# Altium schematic sheet FOC_ESC.SchDoc
size 431 x 279 mm; SheetNumber: 1; SheetTotal: 1
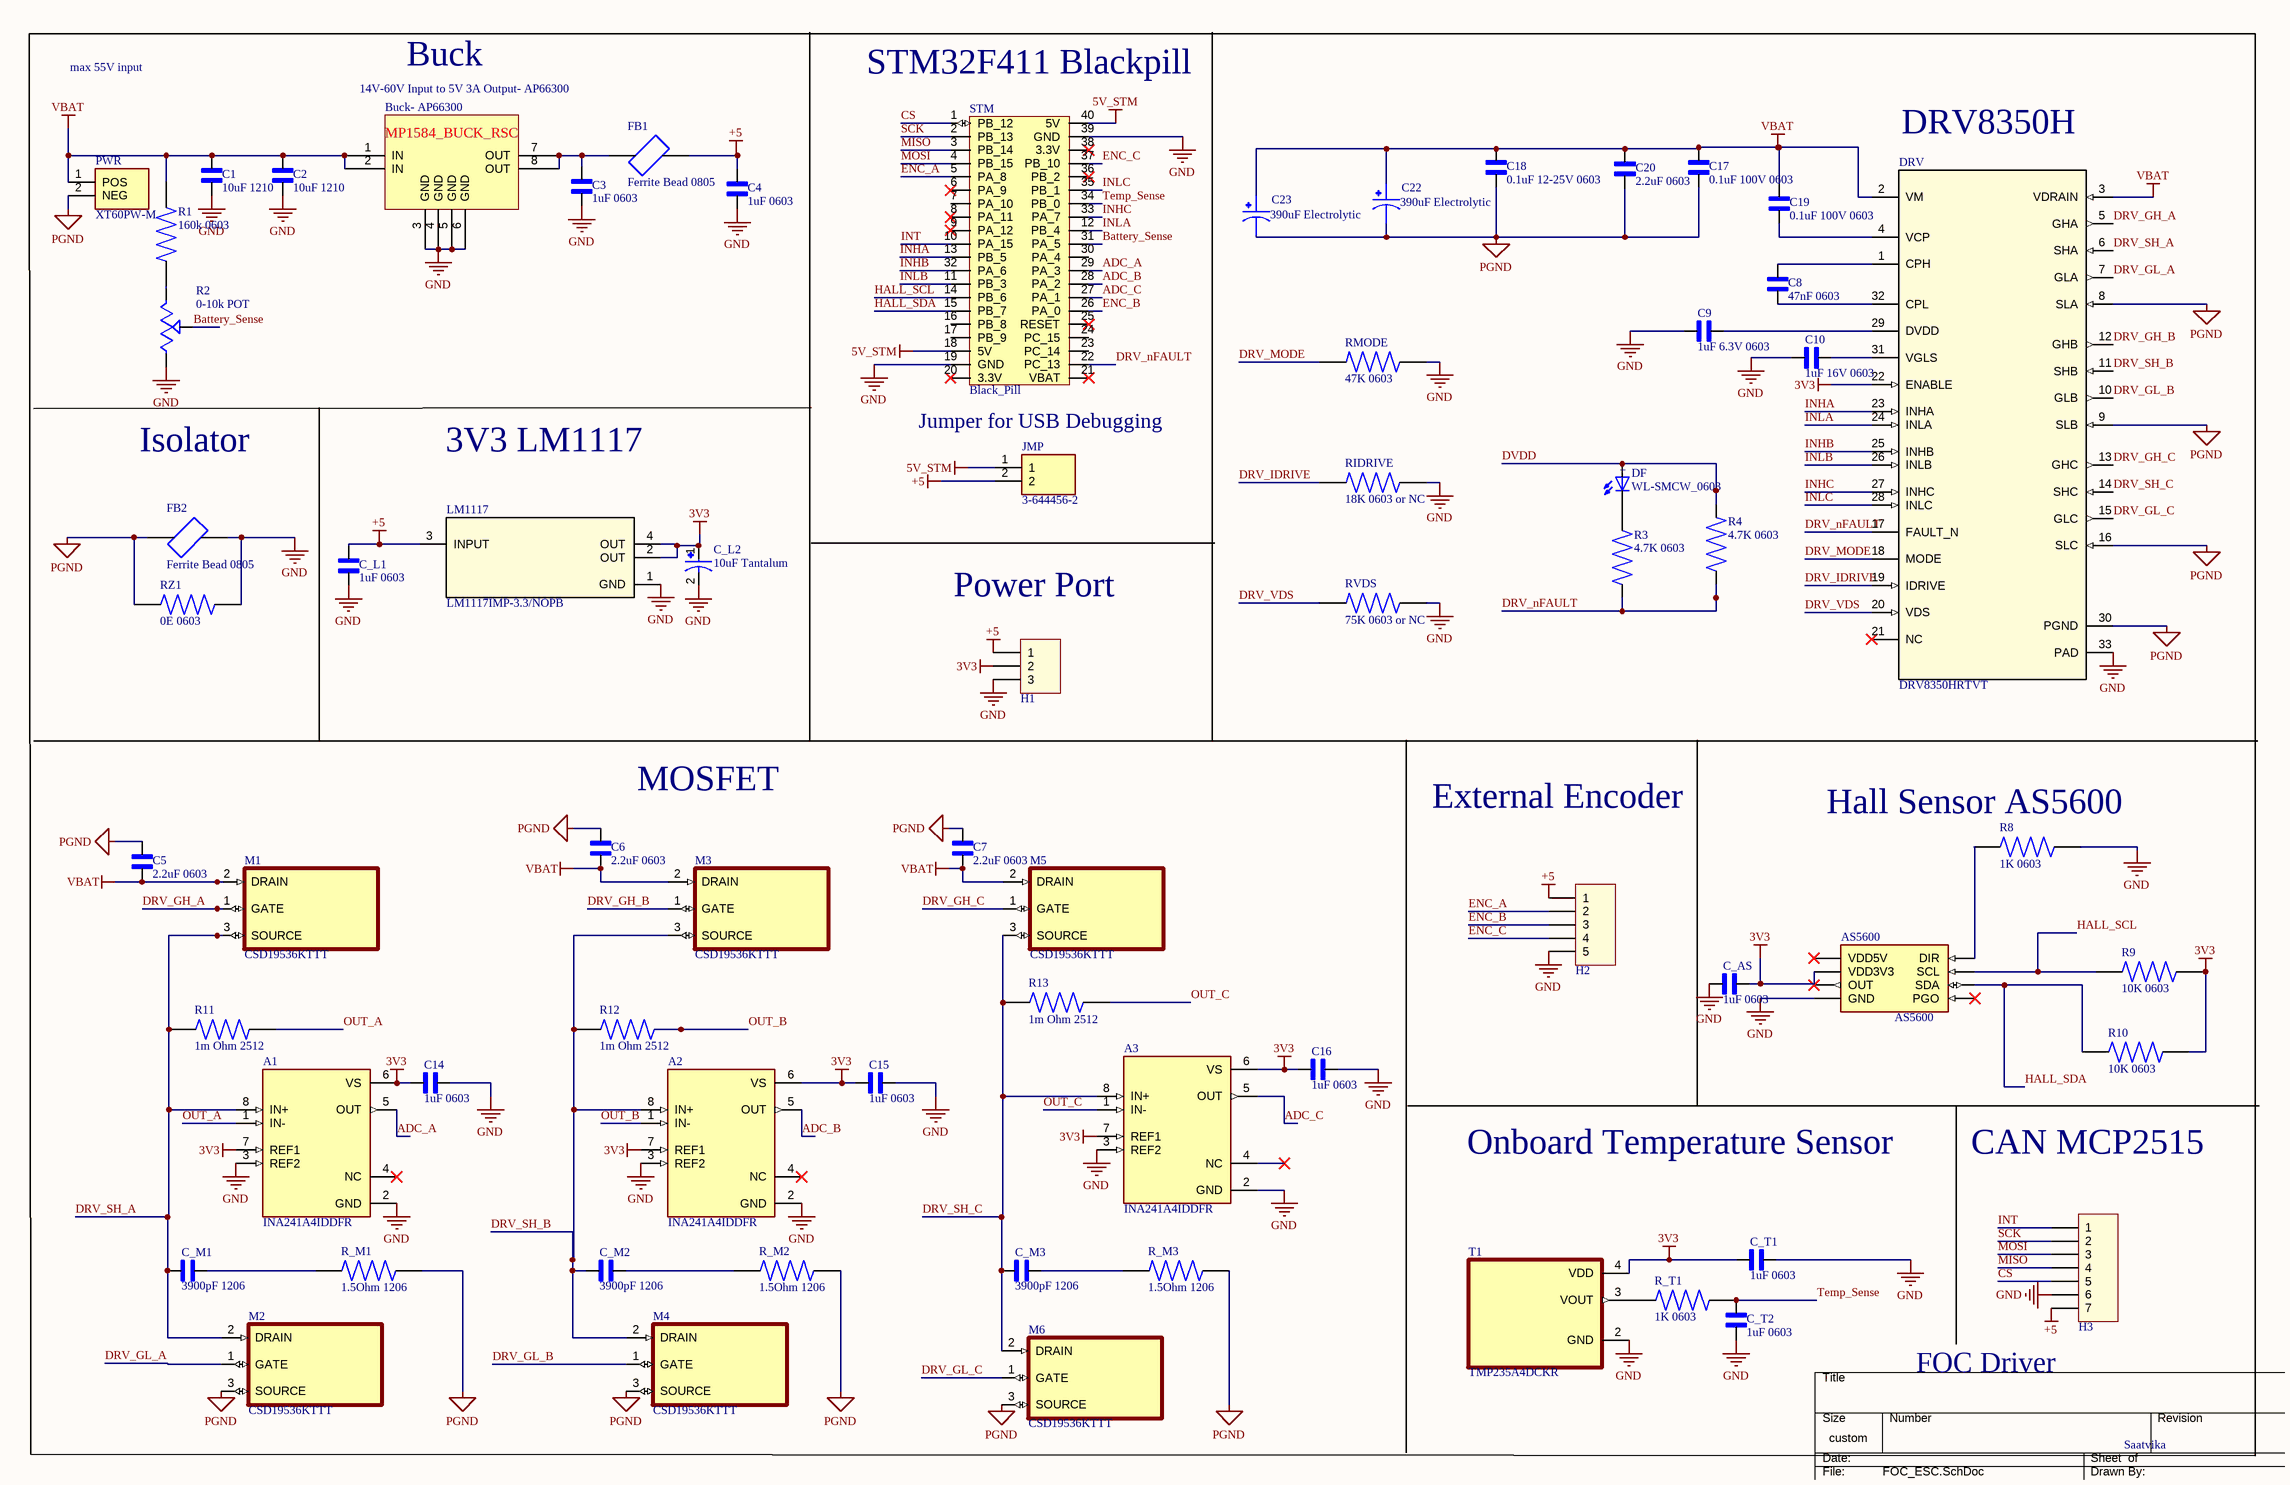
[diagram p0: FOC_ESC.SchDoc]

## Parts
A1  INA241A4IDDFR  [SOT65P280X110-8N]
A2  INA241A4IDDFR  [SOT65P280X110-8N]
A3  INA241A4IDDFR  [SOT65P280X110-8N]
AS5600  AS5600  [SOIC8]  (value not drawn)
Buck-_AP66300  (no value)  [MP1584]
C1  10uF 1210  [CAPC3225X280N]
C2  10uF 1210  [CAPC3225X280N]
C3  1uF 0603  [CAPC1608X90]
C4  1uF 0603  [CAPC1608X90]
C5  2.2uF 0603  [CAPC1608X90]
C6  2.2uF 0603  [CAPC1608X90]
C7  2.2uF 0603  [CAPC1608X90]
C8  47nF 0603  [CAPC1608X90]
C9  1uF 6.3V 0603  [CAPC1608X90]
C10  1uF 16V 0603  [CAPC1608X90]
C14  1uF 0603  [CAPC1608X90]
C15  1uF 0603  [CAPC1608X90]
C16  1uF 0603  [CAPC1608X90]
C17  0.1uF 100V 0603  [CAPC1608X90]
C18  0.1uF 12-25V 0603  [CAPC1608X90]
C19  0.1uF 100V 0603  [CAPC1608X90]
C20  2.2uF 0603  [CAPC1608X90]
C22  390uF Electrolytic  [CAPAE1280X1400N]
C23  390uF Electrolytic  [CAPAE1280X1400N]
C_AS  1uF 0603  [CAPC1608X90]
C_L1  1uF 0603  [CAPC1608X90]
C_L2  10uF Tantalum  [CAPMP3528X210N]
C_M1  3900pF 1206  [CAPC3216X110N]
C_M2  3900pF 1206  [CAPC3216X110N]
C_M3  3900pF 1206  [CAPC3216X110N]
C_T1  1uF 0603  [CAPC1608X90]
C_T2  1uF 0603  [CAPC1608X90]
DF  WL-SMCW_0603  [WL-SMCW_0603]
DRV  DRV8350HRTVT  [RTV0032E]
FB1  Ferrite Bead 0805  [FB_MI0805K400R-10]
FB2  Ferrite Bead 0805  [FB_MI0805K400R-10]
H1  61300311021  [61300311021]  (value not drawn)
H2  61300511021  [61300511021]  (value not drawn)
H3  61300711121  [61300711121]  (value not drawn)
JMP  3-644456-2  [TE_3-644456-2]
LM1117  LM1117IMP-3.3/NOPB  [DCY0004A_N]
M1  CSD19536KTTT  [TO254P1524X483-4N]
M2  CSD19536KTTT  [TO254P1524X483-4N]
M3  CSD19536KTTT  [TO254P1524X483-4N]
M4  CSD19536KTTT  [TO254P1524X483-4N]
M5  CSD19536KTTT  [TO254P1524X483-4N]
M6  CSD19536KTTT  [TO254P1524X483-4N]
PWR  XT60PW-M  [AMASS_XT60PW-M]
R1  160k 0603  [RESC1607X60N]
R2  0-10k POT  [TRIM_3313J-2-104E]
R3  4.7K 0603  [RESC1607X60N]
R4  4.7K 0603  [RESC1607X60N]
R8  1K 0603  [RESC1607X60N]
R9  10K 0603  [RESC1607X60N]
R10  10K 0603  [RESC1607X60N]
R11  1m Ohm 2512  [RESC6432X90N]
R12  1m Ohm 2512  [RESC6432X90N]
R13  1m Ohm 2512  [RESC6432X90N]
R_M1  1.5Ohm 1206  [RESC3116X65N]
R_M2  1.5Ohm 1206  [RESC3116X65N]
R_M3  1.5Ohm 1206  [RESC3116X65N]
R_T1  1K 0603  [RESC1607X60N]
RIDRIVE  18K 0603 or NC  [RESC1607X60N]
RMODE  47K 0603  [RESC1607X60N]
RVDS  75K 0603 or NC  [RESC1607X60N]
RZ1  0E 0603  [RESC1607X60N]
STM  Black_Pill  [Black_Pill_STM32F401CCU6]
T1  TMP235A4DCKR  [SOT65P210X110-5N]

## Nets
3V3: A1.6(VS) A1.7(REF1) A2.6(VS) A2.7(REF1) A3.6(VS) A3.7(REF1) AS5600.2(VDD3V3) C14.2 C15.2 C16.2 C_AS.1 C_L2.1 C_T1.1 DRV.22(ENABLE) H1.2 LM1117.2(OUT) LM1117.4(OUT) R9.2 R10.2 T1.4(VDD)
5V_STM: JMP.1 STM.18(5V) STM.40(5V)
+5: C4.2 C_L1.2 FB1.2 H1.1 H2.1 H3.7 JMP.2 LM1117.3(INPUT)
GND: A1.2(GND) A1.3(REF2) A2.2(GND) A2.3(REF2) A3.2(GND) A3.3(REF2) AS5600.4(GND) Buck-_AP66300.3(GND) Buck-_AP66300.4(GND) Buck-_AP66300.5(GND) Buck-_AP66300.6(GND) C1.1 C2.1 C3.1 C4.1 C9.1 C10.2 C14.1 C15.1 C16.1 C_AS.2 C_L1.1 C_L2.2 C_T1.2 C_T2.1 DRV.33(PAD) FB2.2 H1.3 H2.5 H3.6 LM1117.1(GND) R2.1(CCW) R8.2 RIDRIVE.2 RMODE.2 RVDS.2 RZ1.2 STM.19(GND) STM.39(GND) T1.2(GND)
PGND: C5.2 C6.2 C7.2 C17.1 C18.1 C20.1 C22.2 C23.2 DRV.8(SLA) DRV.9(SLB) DRV.16(SLC) DRV.30(PGND) FB2.1 M2.3(SOURCE) M4.3(SOURCE) M6.3(SOURCE) PWR.2(NEG) R_M1.2 R_M2.2 R_M3.2 RZ1.1
VBAT: Buck-_AP66300.1(IN) Buck-_AP66300.2(IN) C1.2 C2.2 C5.1 C6.1 C7.1 C17.2 C18.2 C19.2 C20.2 C22.1 C23.1 DRV.2(VM) DRV.3(VDRAIN) M1.2(DRAIN) M3.2(DRAIN) M5.2(DRAIN) PWR.1(POS) R1.1
ADC_A: A1.5(OUT) STM.29(PA_3)
ADC_B: A2.5(OUT) STM.28(PA_2)
ADC_C: A3.5(OUT) STM.27(PA_1)
Battery_Sense: R2.2(WIPER) STM.31(PA_5)
CS: H3.5 STM.1(PB_12)
DRV_GH_A: DRV.5(GHA) M1.1(GATE)
DRV_GH_B: DRV.12(GHB) M3.1(GATE)
DRV_GH_C: DRV.13(GHC) M5.1(GATE)
DRV_GL_A: DRV.7(GLA) M2.1(GATE)
DRV_GL_B: DRV.10(GLB) M4.1(GATE)
DRV_GL_C: DRV.15(GLC) M6.1(GATE)
DRV_IDRIVE: DRV.19(IDRIVE) RIDRIVE.1
DRV_MODE: DRV.18(MODE) RMODE.1
DRV_nFAULT: DRV.17(FAULT_N) R3.2 R4.2 STM.22(PC_13)
DRV_SH_A: A1.8(IN+) C_M1.2 DRV.6(SHA) M1.3(SOURCE) M2.2(DRAIN) R11.1
DRV_SH_B: A2.8(IN+) C_M2.2 DRV.11(SHB) M3.3(SOURCE) M4.2(DRAIN) R12.1
DRV_SH_C: A3.8(IN+) C_M3.2 DRV.14(SHC) M5.3(SOURCE) M6.2(DRAIN) R13.1
DRV_VDS: DRV.20(VDS) RVDS.1
DVDD: DF.2(POS) R4.1
ENC_A: H2.2 STM.5(PA_8)
ENC_B: H2.3 STM.26(PA_0)
ENC_C: H2.4 STM.37(PB_10)
HALL_SCL: AS5600.7(SCL) R9.1 STM.14(PB_6)
HALL_SDA: AS5600.6(SDA) R10.1 STM.15(PB_7)
INHA: DRV.23(INHA) STM.13(PB_5)
INHB: DRV.25(INHB) STM.32(PA_6)
INHC: DRV.27(INHC) STM.33(PA_7)
INLA: DRV.24(INLA) STM.12(PB_4)
INLB: DRV.26(INLB) STM.11(PB_3)
INLC: DRV.28(INLC) STM.35(PB_1)
INT: H3.1 STM.10(PA_15)
MISO: H3.4 STM.3(PB_14)
MOSI: H3.3 STM.4(PB_15)
OUT_A: A1.1(IN-) R11.2
OUT_B: A2.1(IN-) R12.2
OUT_C: A3.1(IN-) R13.2
SCK: H3.2 STM.2(PB_13)
Temp_Sense: C_T2.2 R_T1.2 STM.34(PB_0)
NetAS5600_8: AS5600.8(DIR) R8.1
NetBuck-_AP66300_7: Buck-_AP66300.7(OUT) Buck-_AP66300.8(OUT) C3.2 FB1.1
NetC8_1: C8.1 DRV.32(CPL)
NetC8_2: C8.2 DRV.1(CPH)
NetC9_2: C9.2 DRV.29(DVDD)
NetC10_1: C10.1 DRV.31(VGLS)
NetC19_1: C19.1 DRV.4(VCP)
NetC_M1_1: C_M1.1 R_M1.1
NetC_M2_1: C_M2.1 R_M2.1
NetC_M3_1: C_M3.1 R_M3.1
NetDF_1: DF.1(NEG) R3.1
NetR1_2: R1.2 R2.3(CW)
NetR_T1_1: R_T1.1 T1.3(VOUT)

Not connected (* = marked no-connect by the designer): A1 4(NC)*; A2 4(NC)*; A3 4(NC)*; AS5600 1(VDD5V)* 3(OUT)* 5(PGO)*; DRV 21(NC)*; STM 6(PA_9)* 7(PA_10) 8(PA_11)* 9(PA_12)* 16(PB_8) 17(PB_9) 20(3.3V)* 21(VBAT)* 23(PC_14) 24(PC_15) 25(RESET)* 30(PA_4) 36(PB_2)* 38(3.3V)*

## Notes on the sheet
- max 55V input
- 14V-60V Input to 5V 3A Output- AP66300
- Buck
- (near STM) STM32F411 Blackpill
- DRV8350H
- Jumper for USB Debugging
- Isolator
- 3V3 LM1117
- (near H1) Power Port
- MOSFET
- External Encoder
- (near R8) Hall Sensor AS5600
- Onboard Temperature Sensor
- CAN MCP2515
- (near H3) FOC Driver
- Saatvika
- DWG. NO.
- REV.
- SHT.
- THIS DOCUMENT AND THE DATA DISCLOSED HEREIN OR HEREWITH IS THE PROPERTY OF ALTIUM LIMITED AND MAY BE FREELY DISTRIBUTED IN WHOLE. NO RIGHTS ARE RESERVED OR EXPRESS OR IMPLIED WARANTEE GIVEN.
- REVISION
- DESCRIPTION
- DATE
- APPROVED
- ENG:
- APPROVALS
- PROJECT
- DSN:
- CHK:
- REFERENCE DOCUMENTS
- PROJECT REVISION:
- TITLE
- DOCUMENT REVISION:
- DESIGN ITEM:
- BOM:
- FAB DWG:
- PCB DWG:
- ASSY DWG:
- SCALE:
- SIZE
- B
- CAGE CODE
- FILE NAME
- DWG NO.
- SHEET
- OF
- REV
- (in symbol MP1584 Buck Convertor) MP1584_BUCK_RSC
- (in symbol WL-SMCW_0603) +

## Library data of the parts
A1-A3 = INA241A3IDDFR: -5-V to 110-V bidirectional ultraprecise current sense amplifier with enhanced PWM rejection; MF: Texas Instruments; Package: None; Price: None; Check_prices: https://www.snapeda.com/parts/INA241A3IDDFR/Texas+Instruments/view-part/?ref=eda; Value: *; SnapEDA_Link: https://www.snapeda.com/parts/INA241A3IDDFR/Texas+Instruments/view-part/?ref=snap; MP: INA241A3IDDFR; Availability: In Stock; Purchase-URL: https://pricing.snapeda.com/search?q=INA241A3IDDFR&ref=eda
AS5600 = AS5600: Hall Effect Sensor Rotary Position External Magnet, Not Included Gull Wing; MF: Ams AG; SnapEDA_Link: https://www.snapeda.com/parts/AS5600/ams/view-part/?ref=snap; Package: None; Value: *; MP: AS5600; Check_prices: https://www.snapeda.com/parts/AS5600/ams/view-part/?ref=eda
Buck-_AP66300 = MP1584 Buck Convertor
C1 C2 = C1210C106K5RACTU: 10 ÂµF Â±10% 50V Ceramic Capacitor X7R 1210 (3225 Metric); MF: KEMET; SnapEDA_Link: https://www.snapeda.com/parts/C1210C106K5RACTU/KEMET/view-part/?ref=snap; Package: 1210-2 KEMET; Value: *; MP: C1210C106K5RACTU; Check_prices: https://www.snapeda.com/parts/C1210C106K5RACTU/KEMET/view-part/?ref=eda
C3-C10 C14-C20 C_AS C_L1 C_T1 C_T2 = CC0603KRX7R9BB104: 0.1 ÂµF Â±10% 50V Ceramic Capacitor X7R 0603 (1608 Metric); MF: Yageo; SnapEDA_Link: https://www.snapeda.com/parts/CC0603KRX7R9BB104/Yageo/view-part/?ref=snap; Package: 0603 Yageo; Value: *; MP: CC0603KRX7R9BB104; Check_prices: https://www.snapeda.com/parts/CC0603KRX7R9BB104/Yageo/view-part/?ref=eda
C22 C23 = EDH475M450A9RAA: ALU Electrolytic, SMD, EDH, +85Â°C, 450VDC, 12.5ÂµF, 12.5 x 13.5 ¦ KEMET EDH475M450A9RAA; SnapEDA_Link: https://www.snapeda.com/parts/EDH475M450A9RAA/KEMET/view-part/?ref=snap; Package: Radial KEMET; Value: *; MF: KEMET; MP: EDH475M450A9RAA; Check_prices: https://www.snapeda.com/parts/EDH475M450A9RAA/KEMET/view-part/?ref=eda
C_L2 = T543B337K2R5AHW035: Cap Tant Polymer 330uF 2.5VDC B CASE 10% (3.5 X 2.8 X 1.9mm) SMD 3528-21 0.035 Ohm 105Â°C T/R; MF: KEMET; Check_prices: https://www.snapeda.com/parts/T543B337K2R5AHW035/KEMET/view-part/1714462/?ref=eda; Availability: In Stock; Value: *; Price: None; Purchase-URL: https://pricing.snapeda.com/search/part/T543B337K2R5AHW035/?ref=eda; MP: T543B337K2R5AHW035; Package: SMD-2 Kemet; SnapEDA_Link: https://www.snapeda.com/parts/T543B337K2R5AHW035/KEMET/view-part/1714462/?ref=snap
C_M1-C_M3 = C1206C104K2RACTU: 1206 C 100nF Ceramic Multilayer Capacitor, 200 V, +125degC, X7R Dielec, +/-10% | KEMET C1206C104K2RACTU; SnapEDA_Link: https://www.snapeda.com/parts/C1206C104K2RACTU/KEMET/view-part/?ref=snap; Package: 1206-2 KEMET; Value: *; MF: KEMET; MP: C1206C104K2RACTU; Check_prices: https://www.snapeda.com/parts/C1206C104K2RACTU/KEMET/view-part/?ref=eda
DF = WL-SMCW_0603: 0603, Bright Green, Typ.(@20mA): 570nm, 40mcd, 2.0V, 140Â° AlInGaP; MF: Wurth Elektronik; MP: 150060VS75000; SnapEDA_Link: https://www.snapeda.com/parts/150060VS75000/Wurth+Electronics/view-part/?ref=snap; Package: 0603 WÃ¼rth Elektronik; Value: *; Check_prices: https://www.snapeda.com/parts/150060VS75000/Wurth+Electronics/view-part/?ref=eda
DRV = DRV8350HRTVT: 102-V max 3-phase smart gate driver 32-WQFN -40 to 125; Manufacturer_Name: Texas Instruments; TYPE: TYPE; RefDes: RefDes; Copyright: Copyright (C) 2025 Ultra Librarian. All rights reserved.; Manufacturer_Part_Number: DRV8350HRTVT; Datasheet: https://www.ti.com/lit/gpn/drv8350
FB1 FB2 = MI0805K400R-10: EMI Ferrite Chip Bead, 0805, 1500MA, 40 Ohms @100MHz, DCR Max 0.050Ohm | Laird Performance Materials MI0805K400R-10; MF: Laird-Signal Integrity Products; SnapEDA_Link: https://www.snapeda.com/parts/MI0805K400R-10/Laird-Signal+Integrity+Products/view-part/?ref=snap; Package: 0805 Laird; Value: *; MP: MI0805K400R-10; Check_prices: https://www.snapeda.com/parts/MI0805K400R-10/Laird-Signal+Integrity+Products/view-part/?ref=eda
H1 = 61300311021: WR-PHD 2.54 mm THT Angled Pin Header, 3p; Pin Number: 3; Rated Current: 3 A; Working Voltage: 250 VAC; Withstanding Voltage: 500 VAC; Pitch: 2.54 mm; ComponentLink1Description: Manufacturer; ComponentLink1URL: http://www.we-online.de; ComponentLink2Description: Datasheet; ComponentLink2URL: http://katalog.we-online.de/em/datasheet/6130xx11021.pdf; Part Number: 61300311021; Published Date: Aug 2017; Publisher: Wurth Elektronik
H2 = 61300511021: WR-PHD 2.54 mm THT Angled Pin Header, 5p; Pin Number: 5; Rated Current: 3 A; Working Voltage: 250 VAC; Withstanding Voltage: 500 VAC; Pitch: 2.54 mm; ComponentLink1Description: Manufacturer; ComponentLink1URL: http://www.we-online.de; ComponentLink2Description: Datasheet; ComponentLink2URL: http://katalog.we-online.de/em/datasheet/6130xx11021.pdf; Part Number: 61300511021; Published Date: Aug 2017; Publisher: Wurth Elektronik
H3 = 61300711121: WR-PHD 2.54 mm THT Pin Header, 7p; Pin Number: 7; Rated Current: 3 A; Working Voltage: 250 VAC; Withstanding Voltage: 500 VAC; Pitch: 2.54 mm; ComponentLink1Description: Manufacturer; ComponentLink1URL: http://www.we-online.de; ComponentLink2Description: Datasheet; ComponentLink2URL: http://katalog.we-online.de/em/datasheet/6130xx11121.pdf; Part Number: 61300711121; Published Date: Aug 2017; Publisher: Wurth Elektronik
JMP = 3-644456-2: HEADER ASSEMBLY, NARROW, MTA-100, 2 POSITION, STRAIGHT | TE Connectivity 3-644456-2; SnapEDA_Link: https://www.snapeda.com/parts/3-644456-2/TE+Connectivity+AMP+Connectors/view-part/?ref=snap; Package: None; Value: *; MF: TE Connectivity; MP: 3-644456-2; Check_prices: https://www.snapeda.com/parts/3-644456-2/TE+Connectivity+AMP+Connectors/view-part/?ref=eda
LM1117 = LM1117IMP-3.3NOPB: 800-mA 15-V linear voltage regulator 4-SOT-223 -40 to 125; Manufacturer_Name: Texas Instruments; TYPE: TYPE; RefDes: RefDes; Copyright: Copyright (C) 2025 Ultra Librarian. All rights reserved.; Manufacturer_Part_Number: LM1117IMP-3.3/NOPB
M1-M6 = CSD19536KTTT: 100-V, N channel NexFETâ„¢ power MOSFET, single D2PAK, 2.4 mOhm; MF: Texas Instruments; SnapEDA_Link: https://www.snapeda.com/parts/CSD19536KTT/Texas+Instruments/view-part/?ref=snap; Package: TO-263-3 Texas Instruments; Value: *; MP: CSD19536KTT; Check_prices: https://www.snapeda.com/parts/CSD19536KTT/Texas+Instruments/view-part/?ref=eda
PWR = XT60PW-M: Socket, DC supply, male, PIN: 2; MF: AMASS; Check_prices: https://www.snapeda.com/parts/XT60PW-M/AMASS/view-part/?ref=eda; SnapEDA_Link: https://www.snapeda.com/parts/XT60PW-M/AMASS/view-part/?ref=snap; Price: None; Availability: Not in stock; Package: Package; MP: XT60PW-M; Value: *
R1 R3 R4 R8-R10 R_T1 RIDRIVE RMODE RVDS RZ1 = RC0603JR-070RL: 0 Ohms Jumper 0.1W, 1/10W Chip Resistor 0603 (1608 Metric) Moisture Resistant Thick Film; MF: Yageo; SnapEDA_Link: https://www.snapeda.com/parts/RC0603JR-070RL/Yageo/view-part/?ref=snap; Package: 0603 Yageo; Value: *; MP: RC0603JR-070RL; Check_prices: https://www.snapeda.com/parts/RC0603JR-070RL/Yageo/view-part/?ref=eda
R2 = 3313J-2-104E: 100 kOhms 0.125W, 1/8W J Lead Surface Mount Trimmer Potentiometer Cermet 1.0 Turn Top Adjustment; MF: Bourns; SnapEDA_Link: https://www.snapeda.com/parts/3313J-2-104E/Bourns/view-part/?ref=snap; Package: SMD-3 Bourns; Value: *; MP: 3313J-2-104E; Check_prices: https://www.snapeda.com/parts/3313J-2-104E/Bourns/view-part/?ref=eda
R11-R13 = CRE2512-FZ-R007E-3: Resistor, Metal Strip, Res 0.007 Ohms, Pwr-Trg 3 W, Tol 1%, SMD | Bourns CRE2512-FZ-R007E-3; SnapEDA_Link: https://www.snapeda.com/parts/CRE2512-FZ-R007E-3/Bourns/view-part/?ref=snap; Package: 6432 Stackpole; Value: *; MF: Bourns; MP: CRE2512-FZ-R007E-3; Check_prices: https://www.snapeda.com/parts/CRE2512-FZ-R007E-3/Bourns/view-part/?ref=eda
R_M1-R_M3 = RC1206JR-0713RL: 13 Ohms Â±5% 0.25W, 1/4W Chip Resistor 1206 (3216 Metric) Moisture Resistant Thick Film; MF: Yageo; Check_prices: https://www.snapeda.com/parts/RC1206JR-0713RL/Yageo/view-part/?ref=eda; Value: *; Availability: In Stock; MP: RC1206JR-0713RL; Price: None; Package: 3116 Yageo; SnapEDA_Link: https://www.snapeda.com/parts/RC1206JR-0713RL/Yageo/view-part/?ref=snap; Purchase-URL: https://pricing.snapeda.com/search/part/RC1206JR-0713RL/?ref=eda
STM = Black_Pill: STM32F401CCU6
T1 = TMP235A4DCKR: 1C analog temperature sensor, 10 mV/C; MF: Texas Instruments; SnapEDA_Link: https://www.snapeda.com/parts/TMP235A4DCKR/Texas+Instruments/view-part/?ref=snap; Package: SC70-5 Texas Instruments; Value: *; MP: TMP235A4DCKR; Check_prices: https://www.snapeda.com/parts/TMP235A4DCKR/Texas+Instruments/view-part/?ref=eda